# EAGLE design StewartPControl (EAGLE 8.6.0)
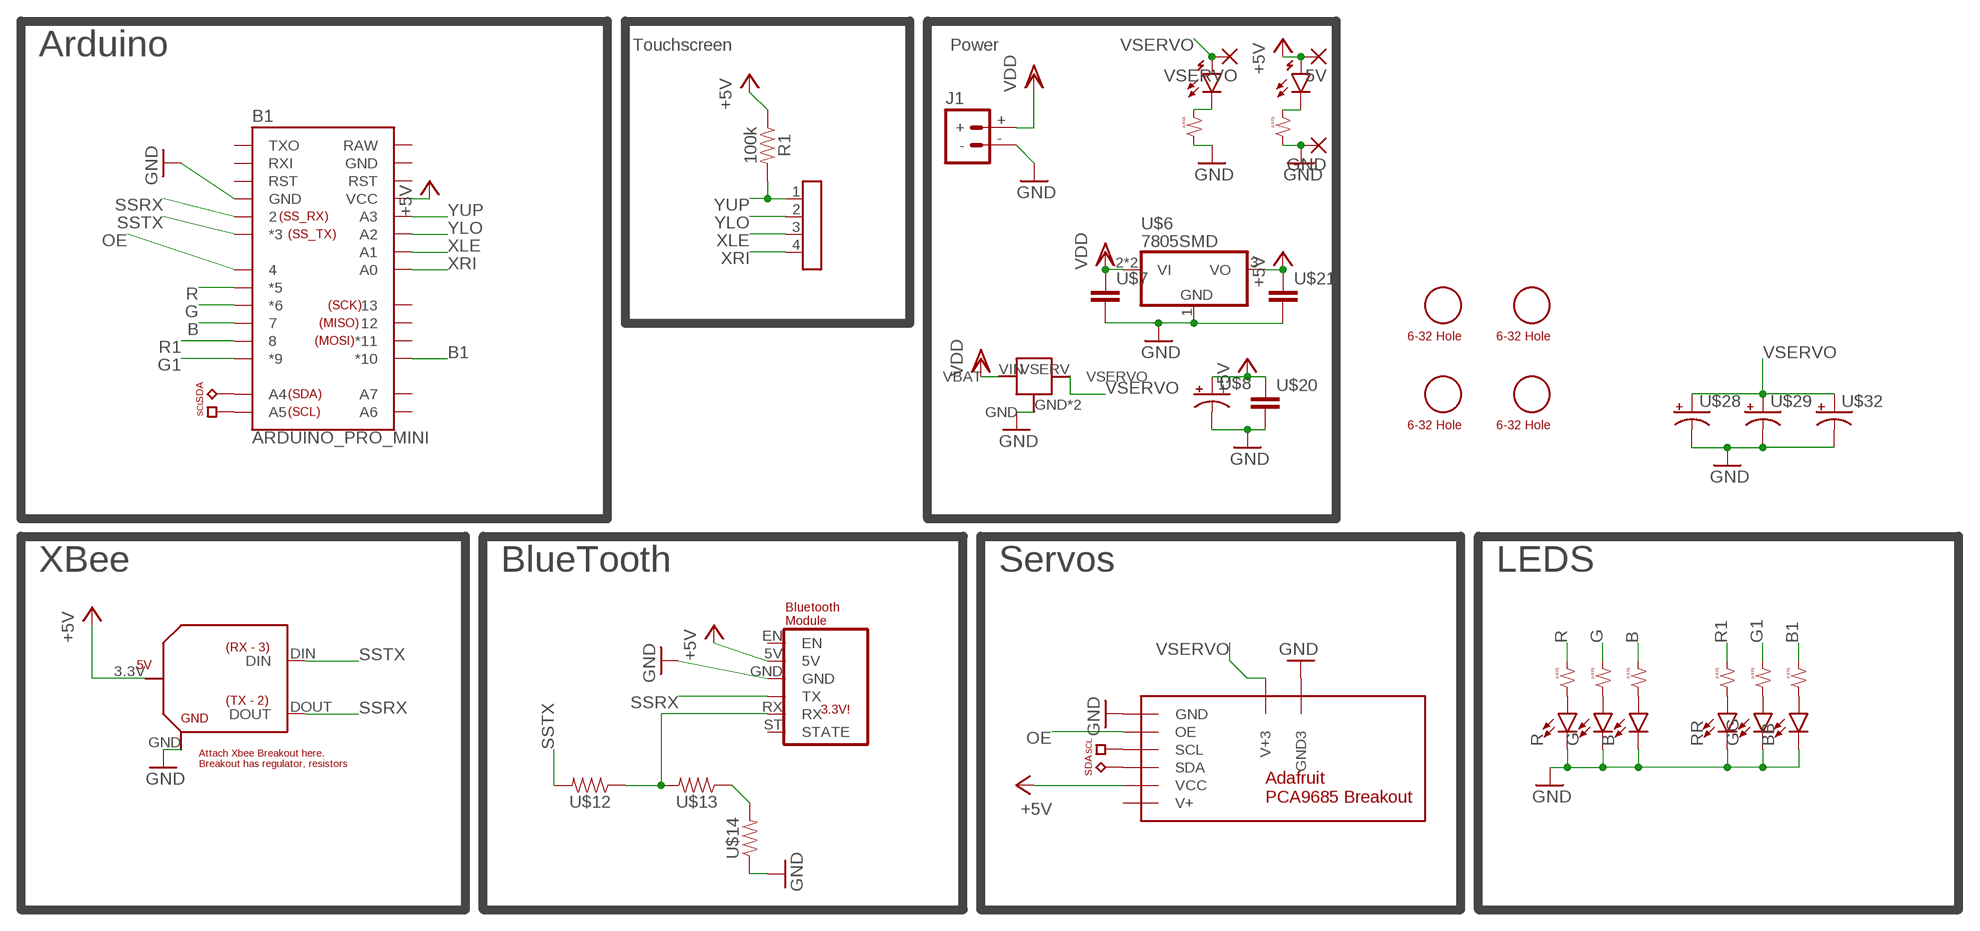
[diagram p0: schematic, sheet 1]

## Parts
5V  PADNRML  [PAD_NRML]
B  LEDSMD  [LED_SMD]
B1  ARDUINO_PRO_MINI  [ARDUINO_PRO_MINI]
BB  LEDSMD  [LED_SMD]
G  LEDSMD  [LED_SMD]
GG  LEDSMD  [LED_SMD]
GND  PADNRML  [PAD_NRML]
J1  BATTERY_CONNMALE  [DEANS_MALE]
R  LEDSMD  [LED_SMD]
R1  100k  RESISTORNORMAL  [RESISTOR]
RR  LEDSMD  [LED_SMD]
U$1  ADA_PCA9685  [ADA_PCA9685]
U$2  XBEE_BOUT_5  [XBEE_BOUT]
U$5  4XHEADER  [4XHEADER]
U$6  7805SMD  [SOT223]
U$7  CAP_SMCAP  [C1206]
U$8  CAP_EMED  [CAP_E]
U$9  POW_LED  [POW_LED_SMD]
U$10  LED_RESISTORSMD  [LED_R1206]
U$11  BT_HC05  [BT_HC05]
U$12  RESISTORSMD  [R1206]
U$13  RESISTORSMD  [R1206]
U$14  RESISTORSMD  [R1206]
U$15  CASTLE_BEC  [CASTLE_BEC]
U$16  632  [632]
U$17  632  [632]
U$18  632  [632]
U$19  632  [632]
U$20  CAP_SMNORM  [CAP_SM]
U$21  CAP_SMCAP  [C1206]
U$22  LED_RESISTORSMD  [LED_R1206]
U$23  POW_LED  [POW_LED_SMD]
U$24  LED_RESISTORNORMAL  [LED_RESISTOR]
U$25  LED_RESISTORNORMAL  [LED_RESISTOR]
U$26  LED_RESISTORNORMAL  [LED_RESISTOR]
U$27  LED_RESISTORSMD  [LED_R1206]
U$28  CAP_EMED  [CAP_E]
U$29  CAP_EMED  [CAP_E]
U$30  LED_RESISTORNORMAL  [LED_RESISTOR]
U$31  LED_RESISTORNORMAL  [LED_RESISTOR]
U$32  CAP_EMED  [CAP_E]
VSERVO  PADNRML  [PAD_NRML]

## Nets
+5V [pow]: 5V.P$2(P) B1.21(VCC) R1.P$1 U$1.VCC U$1.VCC2(VCC) U$2.3.3V U$6.3(VO) U$8.+ U$9.A U$11.5V U$20.1 U$21.1
B: B1.10 U$30.P$2
B1: B1.13(*10) U$27.2
G: B1.9(*6) U$24.P$2
G1: B1.12(*9) U$26.P$2
GND [pow]: B1.4(GND) B.C BB.C G.C GG.C GND.P$2(P) J1.- R.C RR.C U$1.GND U$1.GND2(GND) U$1.GND3 U$2.GND U$6.1(GND) U$7.2 U$8.- U$10.1 U$11.GND U$14.1 U$15.GND U$15.GND2(GND) U$20.2 U$21.2 U$22.1 U$28.- U$29.- U$32.-
N$1: U$13.1 U$14.2
N$2: U$9.C U$10.2
N$3: U$11.RX U$12.1 U$13.2
N$4: U$22.2 U$23.C
N$5: G.A U$24.P$1
N$6: B.A U$30.P$1
N$7: R.A U$31.P$1
N$8: RR.A U$25.P$1
N$9: GG.A U$26.P$1
N$10: BB.A U$27.1
OE: B1.7 U$1.OE U$1.OE2(OE)
R: B1.8(*5) U$31.P$2
R1: B1.11 U$25.P$2
SCL: B1.A5 U$1.SCL U$1.SCL2(SCL) ; supply symbol labelled I2C
SDA: B1.A4 U$1.SDA U$1.SDA2(SDA) ; supply symbol labelled I2C
SSRX: B1.5 U$2.DOUT U$11.TX
SSTX: B1.6(*3) U$2.DIN U$12.2
VDD [pow]: J1.+ U$6.2(VI) U$6.4(VI) U$7.1 U$15.VIN(VBAT)
VSERVO [highPOW]: U$1.V+3 U$15.VSERV(VSERVO) U$23.A U$28.+ U$29.+ U$32.+ VSERVO.P$2(P)
XLE: B1.18(A1) U$5.3
XRI: B1.17(A0) U$5.4
YLO: B1.19(A2) U$5.2
YUP: B1.20(A3) R1.P$2 U$5.1
Unconnected: B1.1(TXO) B1.2(RXI) B1.3(RST) B1.14(*11) B1.15 B1.16 B1.22(RST) B1.A6 B1.A7 U$1.V+ U$1.V+2(V+) U$11.EN U$11.ST(STATE)

## Notes on the sheet
- Touchscreen | Power
- Arduino
- XBee | BlueTooth | Servos | LEDS

## Power pins joined to a net without a drawn wire
GND: B1.23(GND)
RAW: B1.24(RAW)

## Library data of the parts
5V GND VSERVO = Richard_Components:PAD: THROUGH-HOLE PAD
B BB G GG R RR = Richard_Components:LED
B1 = Richard_Micros:ARDUINO_PRO_MINI: SparkFun Pro Mini Pro Mini compatible footprint. Dimensions: 0.7 x 1.3" PCB Thickness: 0.8mm SparkFun Products: 3.3V/8MHz <https://www.sparkfun.com/products/11114> 5V/16MHz <https://www.sparkfun.com/products/11113>
J1 = Richard_Components:BATTERY_CONN: Battery Connectors Various footprints for battery connections SparkFun Products: Deans Connector -M/F Pair <https://www.sparkfun.com/products/11864>
R1 U$12-U$14 = Richard_Resistors:RESISTOR
U$1 = Richard_Boards:ADA_PCA9685
U$2 = Richard_Boards:XBEE_BOUT_5
U$5 = Richard_Headers:4XHEADER
U$6 = Richard_Components:7805
U$7 U$20 U$21 = Richard_Components:CAP_SM
U$8 U$28 U$29 U$32 = Richard_Components:CAP_E
U$9 U$23 = Richard_SpecialComponents:POW_LED
U$10 U$22 U$24-U$27 U$30 U$31 = Richard_Resistors:LED_RESISTOR
U$11 = Richard_Boards:BT_HC05
U$15 = Richard_Experimental:CASTLE_BEC
U$16-U$19 = Richard_Holes:632

## Net classes
0 default: width 0.254 mm
1 pow: width 0.508 mm
2 highPOW: width 0.762 mm

## Board
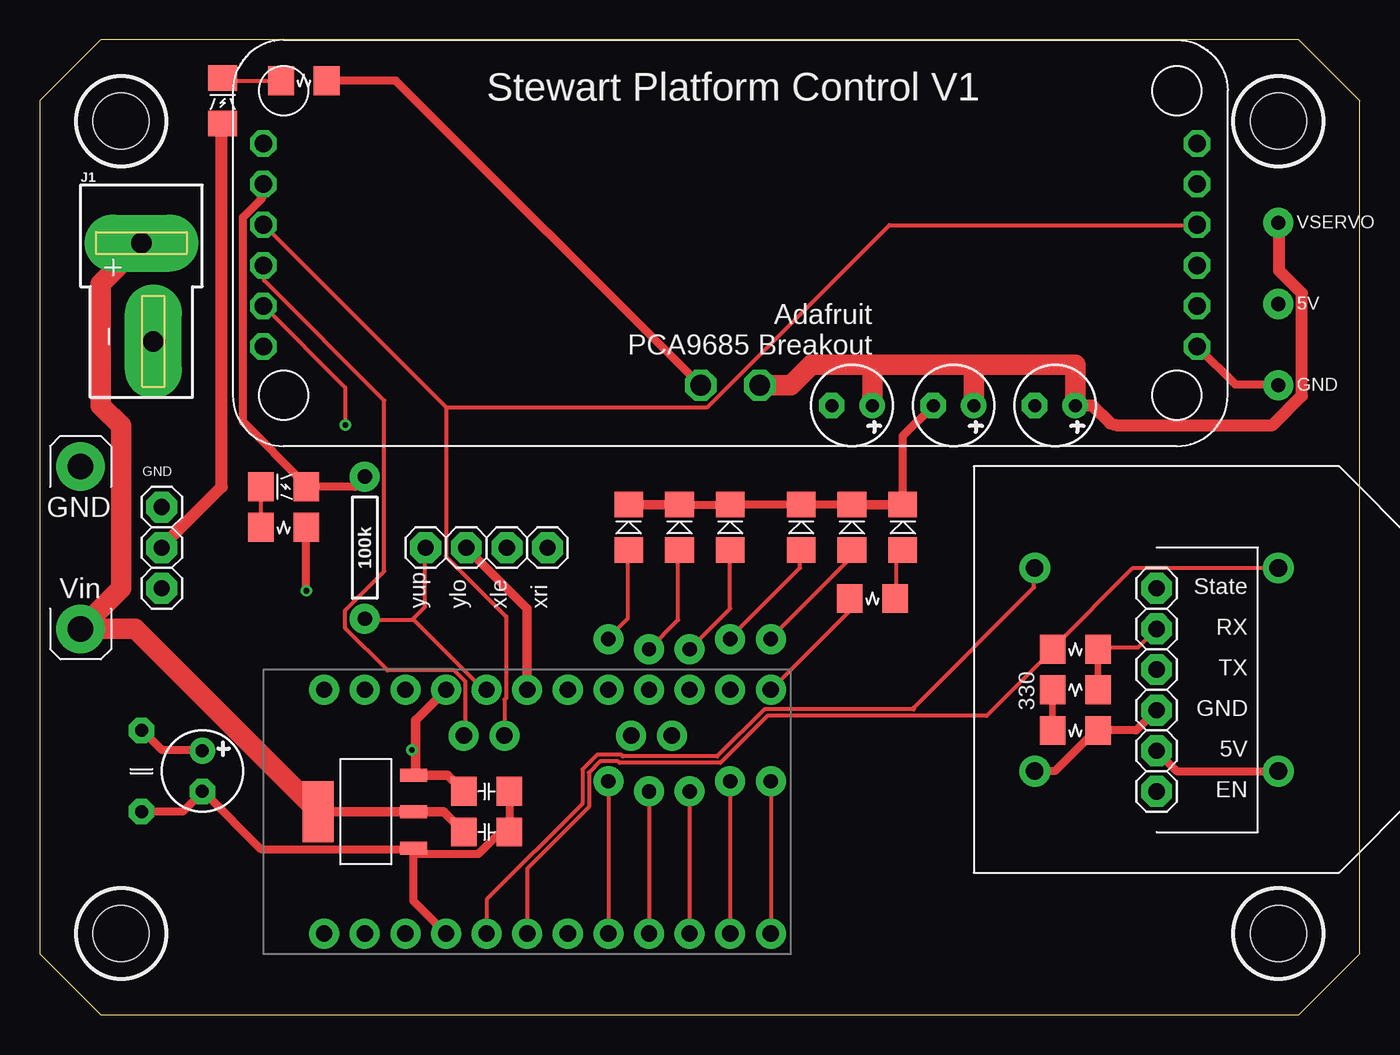
[diagram p1: board, top side]
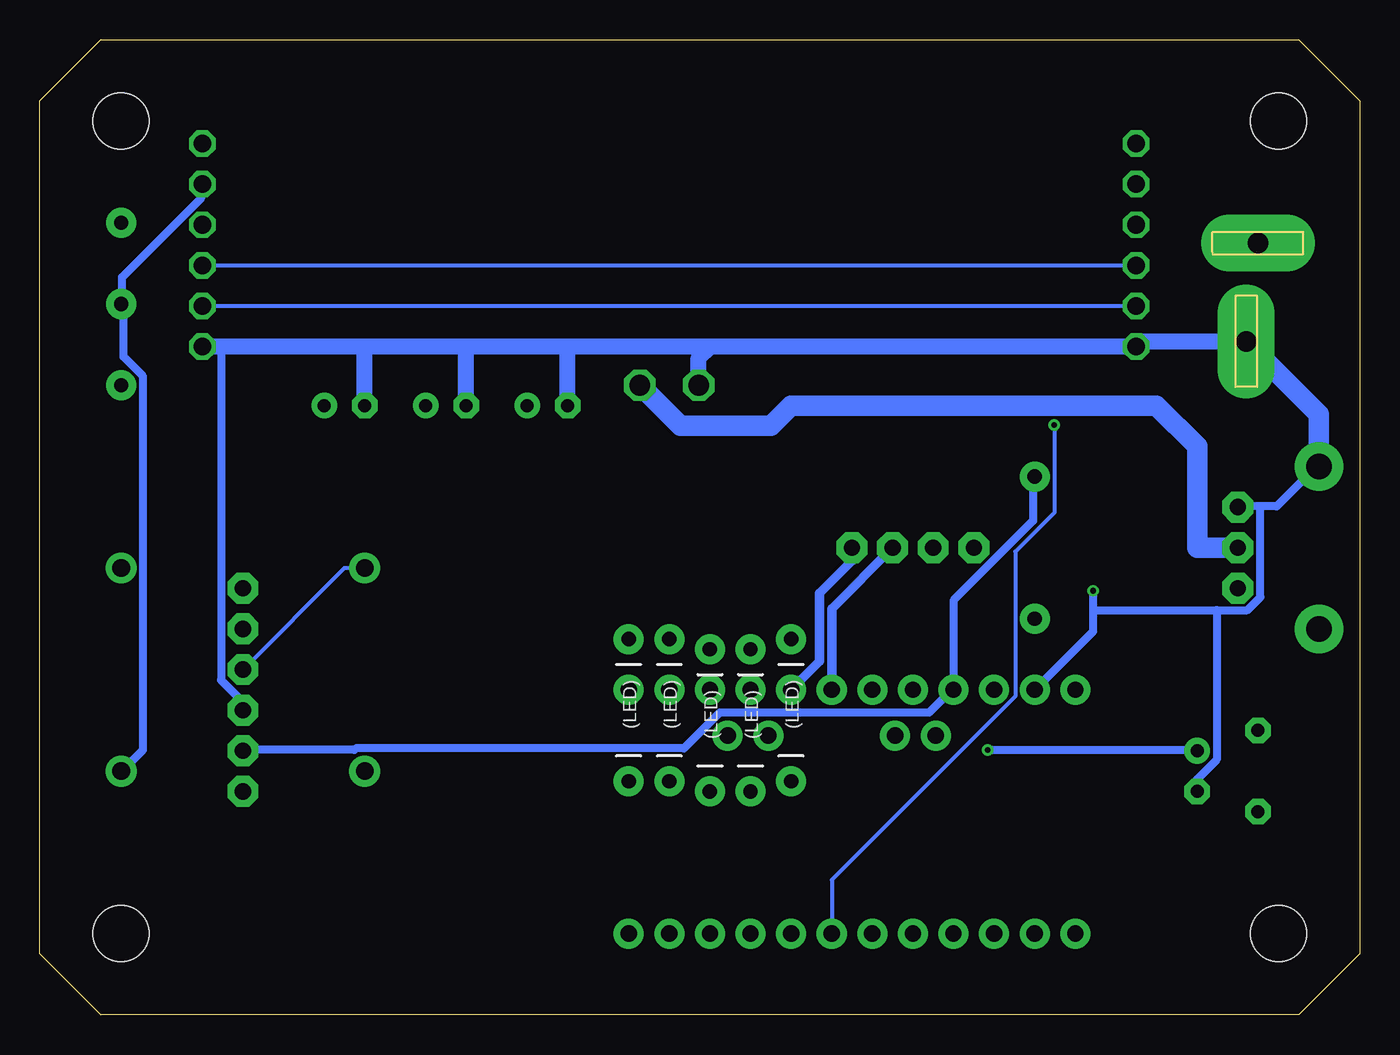
[diagram p2: board, bottom side, seen from below]

Size 82.55 x 60.96 mm. Coordinates in mm from the lower left corner, seen from the top.
Outline: 3.81,0 78.74,0 82.55,3.81 82.55,57.15 78.74,60.96 3.81,60.96 0,57.15 0,3.81 3.81,0
Copper layers (1*16): Top 0.0356mm / dielectric 1.5011mm / Bottom 0.0356mm
Design rules "LaenPCBOrder": minimum track width 6mil, minimum drill 13mil, track to track 6mil, track to pad 6mil, pad to pad 6mil, via to via 6mil, smd to smd 6mil, copper to edge 15mil, drill to drill 6mil, minimum pad ring 7mil, minimum via ring 7mil, stop-mask expansion 3mil, vias tented up to drill 0mil, thermal gap 10mil

### Footprints (pad centres in the part's own frame; a part is rotated, then mirrored left to right if it is on the bottom)
PAD_NRML = drill 0.9 pad 1.88: P$2 0,0
LED_SMD = smd 1.6 x 1.803: A -1.422,0; C 1.422,0
ARDUINO_PRO_MINI = drill 1.016 pad 1.88: 1 -7.62,12.7; 2 -7.62,10.16; 3 -7.62,7.62; 4 -7.62,5.08; 5 -7.62,2.54; 6 -7.62,0; 7 -7.62,-2.54; 8 -7.62,-5.08; 9 -7.62,-7.62; 10 -7.62,-10.16; 11 -7.62,-12.7; 12 -7.62,-15.24; 13 7.62,-15.24; 14 7.62,-12.7; 15 7.62,-10.16; 16 7.62,-7.62; 17 7.62,-5.08; 18 7.62,-2.54; 19 7.62,0; 20 7.62,2.54; 21 7.62,5.08; 22 7.62,7.62; 23 7.62,10.16; 24 7.62,12.7; A4 4.763,1.429; A5 4.763,3.969; A6 4.763,-9.049; A7 4.763,-6.509
DEANS_MALE = drill 1.27 pad 3.556 long: + 0,-1.27; - 0.737,-7.429
RESISTOR = drill 0.9 pad 1.88: P$1 -4.445,0; P$2 4.445,0
ADA_PCA9685 = drill 1.1 octagon: GND -29.21,19.177; GND2 29.21,19.177; OE -29.21,16.637; OE2 29.21,16.637; SCL -29.21,14.097; SCL2 29.21,14.097; SDA -29.21,11.557; SDA2 29.21,11.557; V+ -29.21,6.477; V+2 29.21,6.477; VCC -29.21,9.017; VCC2 29.21,9.017 | drill 1.3 octagon: GND3 1.841,21.59; V+3 -1.841,21.59
XBEE_BOUT = drill 1.1 pad 1.93: 3.3V -7.62,6.35; DIN -7.62,-6.35; DOUT 7.62,-6.35; GND 7.62,6.35
4XHEADER = drill 1.016 pad 1.93 octagon: 1 0,3.81; 2 0,1.27; 3 0,-1.27; 4 0,-3.81
SOT223 = smd 0.813 x 1.676: 1 -2.286,-3.048; 2 0,-3.048; 3 2.286,-3.048 | smd 3.81 x 1.93: 4 0,2.921
C1206 = smd 1.6 x 1.803: 1 -1.422,0; 2 1.422,0
CAP_E = drill 0.813 pad 1.6: + -1.27,0 | drill 0.813 pad 1.6 octagon: - 1.27,0
POW_LED_SMD = smd 1.803 x 1.6: A 0,1.422; C 0,-1.422
LED_R1206 = smd 1.6 x 1.803: 1 -1.422,0; 2 1.422,0
BT_HC05 = drill 1.016 pad 1.93 octagon: 5V 0,3.81; EN 0,6.35; GND 0,1.27; RX 0,-3.81; ST 0,-6.35; TX 0,-1.27
R1206 = smd 1.6 x 1.803: 1 -1.422,0; 2 1.422,0
CASTLE_BEC = drill 1.6 pad 3.048: GND 0,-5.08; VIN 0,5.08 | drill 1.016 pad 1.93 octagon: GND2 -5.08,-2.54; SIG -5.08,2.54; VSERV -5.08,0
632 = hole 3.5: 0,0
CAP_SM = drill 0.813 pad 1.6 octagon: 1 -2.54,0; 2 2.54,0
LED_RESISTOR = drill 0.9 pad 1.88: P$1 -4.445,0; P$2 4.445,0

### Placement (x,y rotation side)
5V  77.47,44.45 0 top
B  43.18,30.48 90 top
B1  30.48,12.7 90 top
BB  53.98,30.48 90 top
G  40.01,30.48 90 top
GG  50.8,30.48 90 top
GND  77.47,39.37 0 top
J1  6.35,49.53 0 top
R  36.83,30.48 90 top
R1  20.32,29.21 270 top
RR  47.62,30.48 90 top
U$1  43.18,60.96 180 top
U$2  69.85,21.59 180 top
U$5  27.94,29.21 90 top
U$6  20.32,12.7 90 top
U$7  27.94,11.43 0 top
U$8  10.16,15.24 270 top
U$9  15.24,33.02 270 top
U$10  15.24,30.48 180 top
U$11  69.85,20.32 180 top
U$12  64.77,22.86 180 top
U$13  64.77,20.32 0 top
U$14  64.77,17.78 180 top
U$15  2.54,29.21 180 top
U$16  5.08,5.08 0 top
U$17  77.47,5.08 0 top
U$18  5.08,55.88 0 top
U$19  77.47,55.88 0 top
U$20  6.35,15.24 270 top
U$21  27.94,13.97 0 top
U$22  16.51,58.42 180 top
U$23  11.43,57.15 180 top
U$24  38.1,18.41 270 bottom
U$25  43.18,19.05 270 bottom
U$26  45.72,19.05 270 bottom
U$27  52.07,26.04 180 top
U$28  50.8,38.1 180 top
U$29  57.15,38.1 180 top
U$30  40.64,18.41 270 bottom
U$31  35.56,19.05 270 bottom
U$32  63.5,38.1 180 top
VSERVO  77.47,49.53 0 top

### Tracks (layer width: path | path; a pad name or v marks a point on that pad's centre or on a via)
+5V  (via drill 0.35)
  Top 0.508: R1.P$1 20.32,33.63 19.71,33.02 U$9.A 16.56,33.22 12.7,37.08 12.7,49.89 13.92,51.1 13.92,51.92 U$1.VCC2 | U$2.3.3V 71.12,15.24 U$11.5V | U$8.+ 10.16,16.56 7.62,16.56 6.4,17.78 U$20.1 | v23.27,16.56 23.5,16.56
  Top 0.61: B1.21 23.5,18.41 23.5,16.56 23.5,14.99 U$6.3 25.5,14.99 U$21.1
  Bottom 0.508: R1.P$1 20.42,33.43 20.42,30.89 25.4,25.91 B1.21 25.6,20.22 26.92,18.9 40.03,18.9 42.27,16.66 62.79,16.66 62.89,16.56 69.8,16.56 U$11.5V | U$1.VCC 72.44,51.92 72.44,51.1 77.42,46.13 77.42,44.5 5V.P$2 77.32,44.3 77.32,41.15 76.1,39.93 76.1,16.56 77.42,15.24 U$2.3.3V | v23.27,16.56 10.16,16.56 U$8.+
B
  Top 0.254: U$30.P$2 B1.10
B1
  Top 0.254: B1.13 50.6,25.2 50.6,26.01 U$27.2
G
  Top 0.254: U$24.P$2 B1.9
G1
  Top 0.254: U$26.P$2 B1.12
GND  (via drill 0.35)
  Top 0.508: v16.66,26.52 U$10.1 | U$10.1 | B.C 40.23,31.9 G.C | B.C | GG.C 50.6,31.9 47.65,31.9 RR.C 47.45,31.9 43.38,31.9 B.C | U$11.GND 68.58,17.78 U$14.1 65.94,17.68 63.5,15.24 U$2.GND | U$21.2 29.36,13.92 29.36,11.48 U$7.2 29.16,11.28 28.65,11.28 27.43,10.06 23.57,10.06 U$6.1 | U$6.1 23.37,7.11 B1.4 | U$22.1 22.25,58.42 41.25,39.42 U$1.GND3 | 23.16,10.36 U$6.1 | GND.P$2 77.42,39.42 74.78,39.42 72.44,41.76 U$1.GND | BB.C 53.98,36.2 U$29.- | U$20.2 8.94,12.7 10.16,13.92 U$8.- 10.36,13.82 13.82,10.36 22.96,10.36 U$6.1
  Top 0.61: BB.C GG.C | R.C G.C
  Bottom 0.508: 16.66,25.3 16.66,23.98 B1.23 | 16.66,25.3 v16.66,26.52 | 71.22,41.78 71.22,20.93 69.9,19.61 69.9,19.1 U$11.GND | 49.58,38.1 U$28.- | 62.28,38.1 U$32.- | 6.2,31.8 5.18,31.8 3.05,33.93 U$15.GND | 6.2,31.8 7.62,31.8 U$15.GND2 | 6.2,31.8 6.2,26.11 7.01,25.3 8.94,25.3 | 16.66,25.3 8.94,25.3 | U$8.- 10.16,14.73 8.94,15.95 8.94,25.3
  Bottom 1.016: J1.- 13.65,42.1 U$1.GND2 40.64,41.78 | 40.64,41.78 49.53,41.78 | 49.53,41.78 55.88,41.78 | 55.88,41.78 62.23,41.78 | 62.23,41.78 71.22,41.78 U$1.GND | U$1.GND3 41.34,41.08 40.64,41.78 | U$28.- 49.53,41.78 | U$29.- 55.88,41.78 | U$32.- 62.23,41.78
  Bottom 1.27: J1.- 2.54,37.55 U$15.GND
N$1
  Top 0.406: U$14.2 U$13.1
N$2
  Top 0.254: U$9.C U$10.2 | U$10.2 | U$9.C
N$3
  Top 0.254: U$11.RX 68.68,22.96 66.34,22.96 U$12.1
  Top 0.406: U$13.2 U$12.1
N$4
  Top 0.254: U$22.2 11.58,58.42 11.48,58.52 U$23.C
N$5
  Top 0.254: U$24.P$1 39.93,24.69 39.93,29.06 G.A
N$6
  Top 0.254: B.A 43.18,25.4 U$30.P$1
N$7
  Top 0.254: R.A 36.78,29.06 36.78,24.79 35.56,23.57 U$31.P$1
N$8
  Top 0.254: RR.A 47.55,29.06 47.55,27.94 43.18,23.57 U$25.P$1
N$9
  Top 0.254: GG.A 50.8,28.65 45.72,23.57 U$26.P$1
N$10
  Top 0.254: U$27.1 53.54,26.11 53.54,28.65 53.95,29.06 BB.A
OE  (via drill 0.35)
  Top 0.254: v19.1,36.88 19.1,39.22 14.02,44.3 U$1.OE2
  Bottom 0.254: 14.02,44.3 U$1.OE2 14.12,44.3 72.24,44.3 U$1.OE 72.34,44.3 | B1.7 33.02,8.43 21.54,19.91 21.54,28.96 19.1,31.39 v19.1,36.88
R
  Top 0.254: U$31.P$2 B1.8
R1
  Top 0.254: U$25.P$2 B1.11
SCL
  Top 0.254: U$1.SCL2 14.02,46.84 14.02,45.92 21.54,38.41 21.54,27.74 19.1,25.3 19.1,24.18 21.74,21.54 25.91,21.54 26.62,20.83 26.62,17.58 26.52,17.48 B1.A5
  Bottom 0.254: 72.34,46.84 U$1.SCL 72.24,46.84 14.12,46.84 U$1.SCL2 14.02,46.84
SDA
  Top 0.254: 25.4,38 25.4,28.65 29.16,24.89 29.16,19.81 29.06,19.71 29.06,17.48 B1.A4 | 25.4,38 14.02,49.38 U$1.SDA2 | 25.4,38 41.76,38 53.14,49.38 72.34,49.38 U$1.SDA
SSRX
  Top 0.254: B1.5 27.94,7.21 33.93,13.21 33.93,15.34 34.85,16.26 36.37,16.26 36.47,16.15 42.37,16.15 45.31,19.1 54.66,19.1 54.66,19.2 62.18,26.72 62.18,27.94 U$2.DOUT
  Bottom 0.254: U$2.DOUT 63.5,27.94 U$11.TX
SSTX
  Top 0.254: B1.6 30.48,9.14 34.34,13.01 34.34,15.14 35.05,15.85 36.17,15.85 36.27,15.75 42.57,15.75 45.52,18.69 59.23,18.69 63.3,22.76 U$12.2 63.4,22.96 68.38,27.94 U$2.DIN
VDD
  Top 0.61: U$6.4 U$6.2 25.25,12.7 U$7.1
  Top 1.27: J1.+ 3.81,45.72 3.81,38.1 5.08,36.83 5.08,26.67 U$15.VIN 5.97,24.13 U$6.4
VSERVO
  Top 0.762: U$23.A 11.38,55.68 11.38,33.02 7.62,29.26 U$15.VSERV | VSERVO.P$2 77.52,49.48 77.52,46.53 78.94,45.11 78.94,38.71 77.11,36.88 67.31,36.88 66.95,36.98 65.84,38.1 U$32.+
  Top 1.27: U$1.V+3 46.99,39.37 48.26,40.64 52.07,40.64 | U$32.+ 64.77,40.64 58.42,40.64 | 52.07,40.64 58.42,40.64 | U$29.+ 58.42,40.64 | U$28.+ 52.07,40.64
  Bottom 1.27: U$15.VSERV 10.16,29.21 10.16,35.56 12.7,38.1 35.56,38.1 36.83,36.83 42.48,36.83 U$1.V+3
XLE
  Bottom 0.61: U$5.3 33.02,25.4 B1.18
XRI
  Bottom 0.61: U$5.4 31.75,28.38 33.78,26.35 33.78,22.1 B1.17
YLO
  Top 0.61: U$5.2 30.48,25.4 B1.19
YUP
  Top 0.254: B1.20 27.74,20.32 23.37,24.69 | 23.37,24.69 20.32,24.69 R1.P$2 | U$5.1 24.08,29.16 24.08,25.5 23.37,24.79 23.37,24.69

### Text on the board
tPlace: Stewart Platform Control V1 | yup | ylo | xle | xri | 330